# EAGLE design MultiNavFW_9250_RevA (EAGLE 7.2.0)
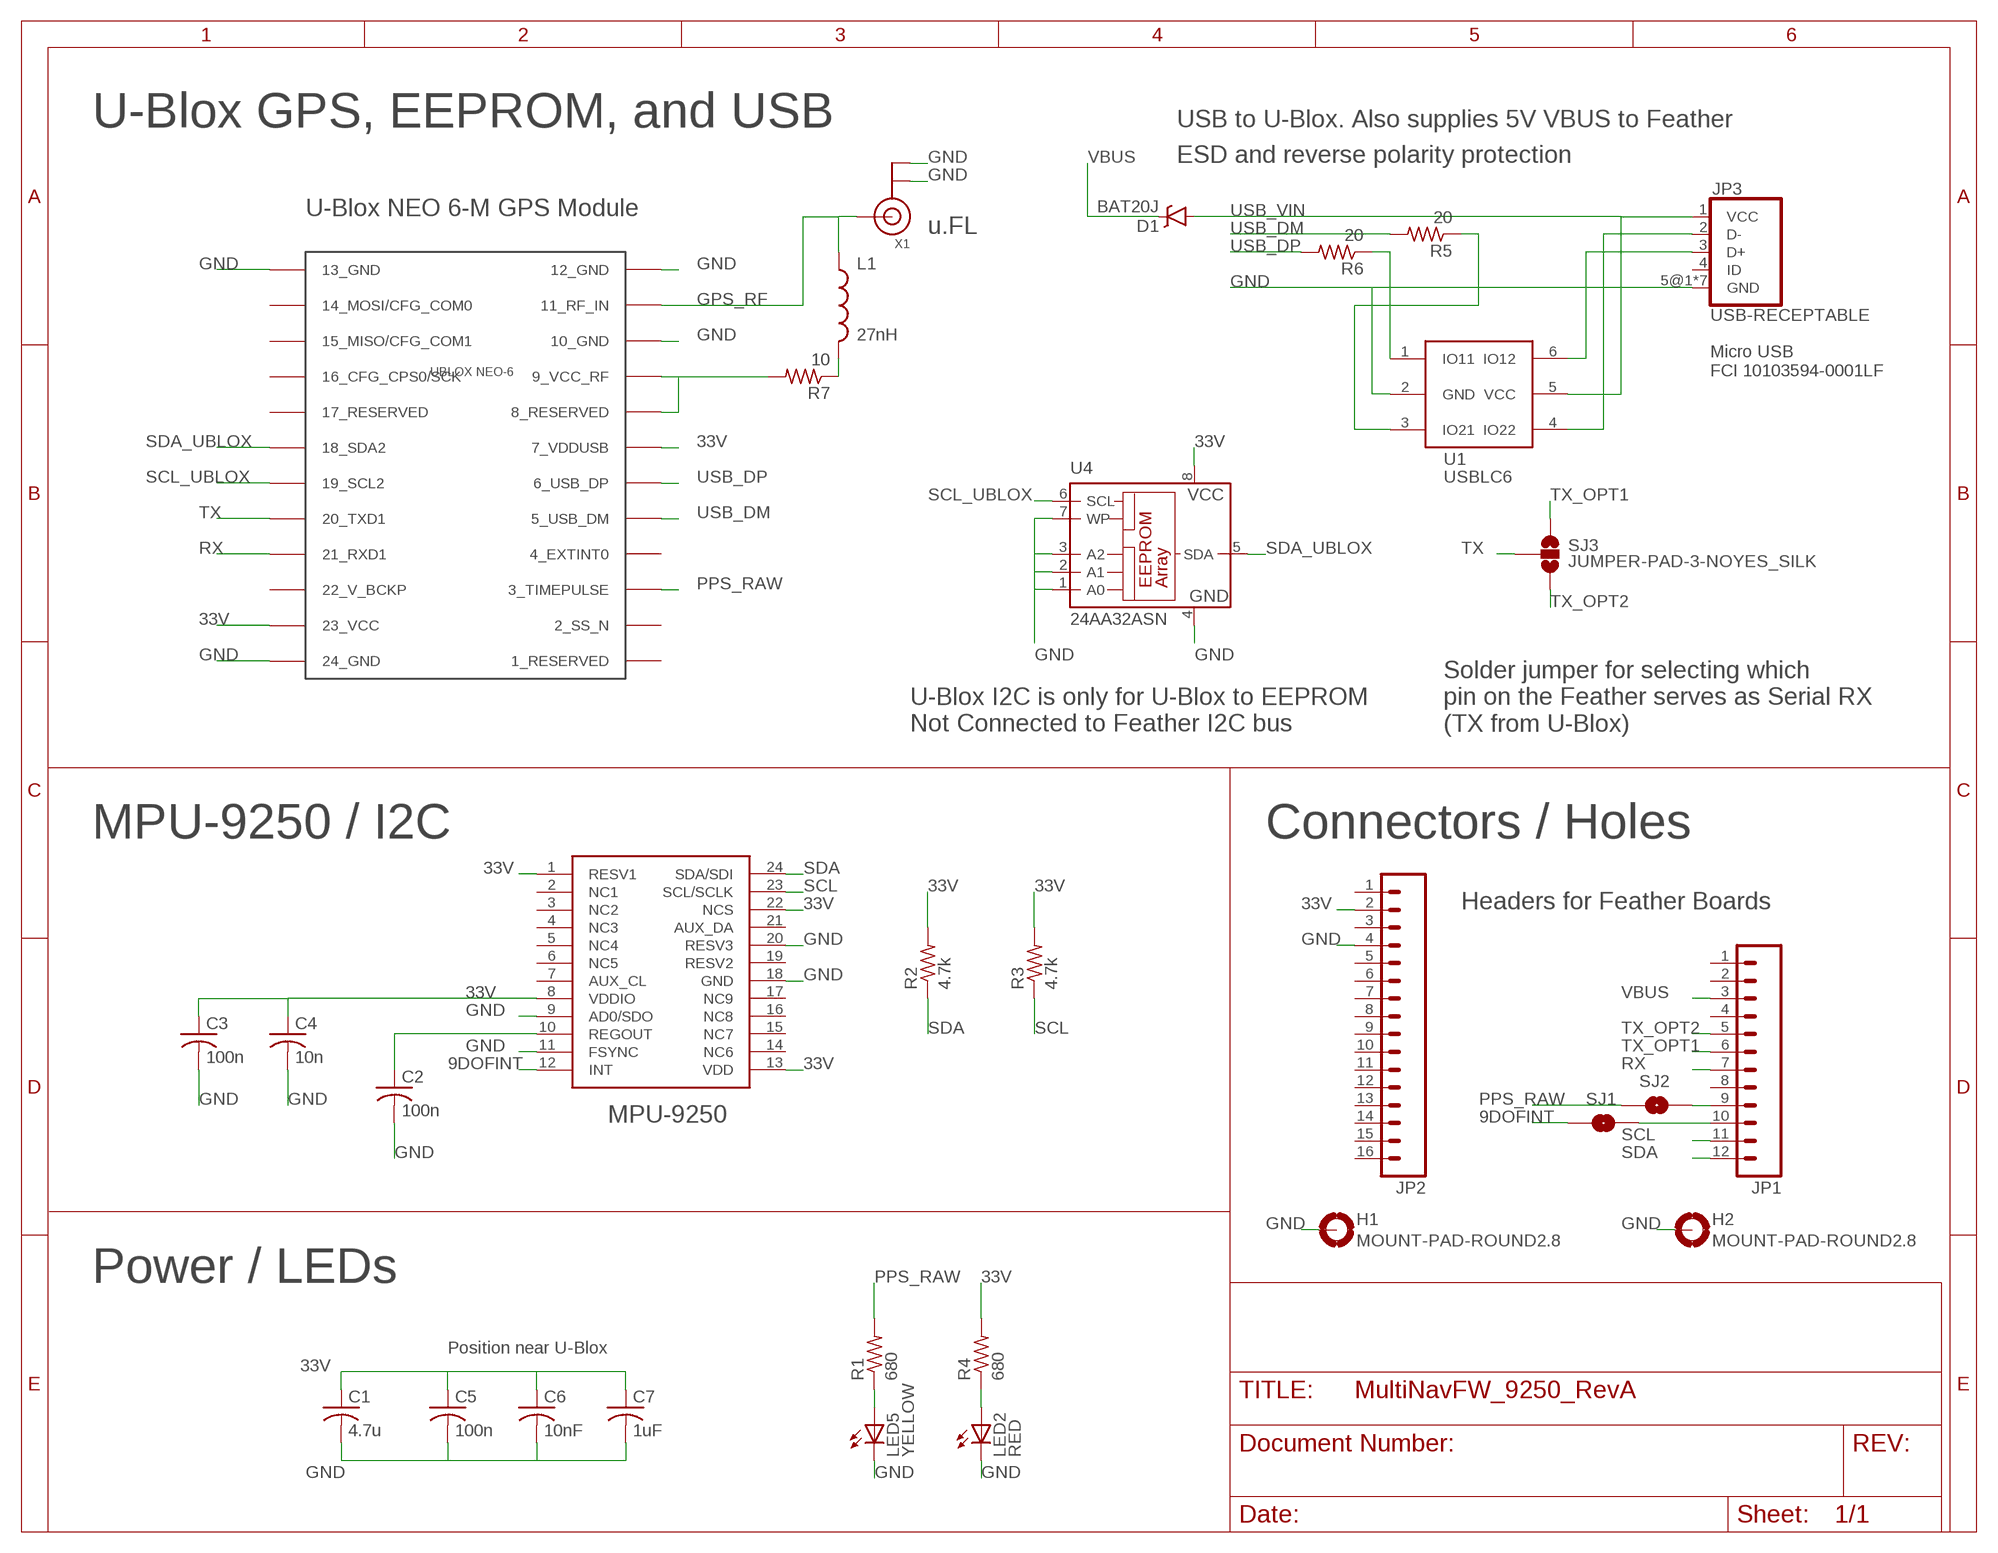
[diagram p0: schematic, sheet 1]

## Parts
C1  4.7u  C-USC0603  [C0603]
C2  100n  C-USC0603  [C0603]
C3  100n  C-USC0603  [C0603]
C4  10n  C-USC0603  [C0603]
C5  100n  C-USC0603  [C0603]
C6  10nF  C-USC0603  [C0603]
C7  1uF  C-USC0603  [C0603]
D1  BAT20J  DIODE-SCHOTTKY-BAT20J  [SOD-323]
H1  MOUNT-PAD-ROUND2.8  [2,8-PAD]
H2  MOUNT-PAD-ROUND2.8  [2,8-PAD]
JP1  M12NO_SILK  [1X12_NO_SILK]
JP2  M161X16_NO_SILK  [1X16_NO_SILK]
JP3  USB-RECEPTABLE  [FCI-10103594-0001LF]
L1  27nH  INDUCTOR0402  [C0402]
LED2  RED  LEDCHIPLED_0603  [CHIPLED_0603]
LED5  YELLOW  LEDCHIPLED_0603  [CHIPLED_0603]
R1  680  R-US_R0603  [R0603]
R2  4.7k  R-US_R0603  [R0603]
R3  4.7k  R-US_R0603  [R0603]
R4  680  R-US_R0603  [R0603]
R5  20  R-US_R0603  [R0603]
R6  20  R-US_R0603  [R0603]
R7  10  R-US_R0603  [R0603]
SJ1  SOLDERJUMPERNO  [SJ_2S-NO]
SJ2  SOLDERJUMPERNO  [SJ_2S-NO]
SJ3  JUMPER-PAD-3-NOYES_SILK  [PAD-JUMPER-3-NO_YES_SILK]
U1  USBLC6-2  [SOT23-6]
U2  MPU-9250  [LEAD-QFN24]
U3  UBLOX_NEO-6  [UBLOX_NEO-6P]
U4  24AA32ASN  [SO-08]
X1  ANTENNA_U.FL  [U.FL]

## Nets
9DOFINT: SJ1.1 U2.12(INT)
33V: C1.1 C3.1 C4.1 C5.1 C6.1 C7.1 JP2.2 R2.2 R3.2 R4.2 U2.1(RESV1) U2.8(VDDIO) U2.13(VDD) U2.22(NCS) U3.7_VDDUSB U3.23_VCC U4.8(VCC)
GND: C1.2 C2.2 C3.2 C4.2 C5.2 C6.2 C7.2 H1.B2,8(MOUNT) H2.B2,8(MOUNT) JP2.4 JP3.5@1(GND) JP3.5@2(GND) JP3.5@3(GND) JP3.5@4(GND) JP3.5@5(GND) JP3.5@6(GND) JP3.5@7(GND) LED2.C LED5.C U1.2(GND) U2.9(AD0/SDO) U2.11(FSYNC) U2.18(GND) U2.20(RESV3) U3.10_GND U3.12_GND U3.13_GND U3.24_GND U4.1(A0) U4.2(A1) U4.3(A2) U4.4(GND) U4.7(WP) X1.1(GND) X1.2(GND)
GPS_BIAS: R7.2 U3.8_RESERVED U3.9_VCC_RF
GPS_RF: L1.1 U3.11_RF_IN X1.3(SIGNAL)
N$1: L1.2 R7.1
N$2: JP3.2(D-) U1.4(IO22)
N$3: R5.1 U1.3(IO21)
N$5: R6.1 U1.1(IO11)
N$6: LED5.A R1.1
N$7: JP3.3(D+) U1.6(IO12)
N$9: LED2.A R4.1
N$10: JP1.10 SJ1.2
N$12: JP1.9 SJ2.2
N$13: C2.1 U2.10(REGOUT)
PPS_RAW: R1.2 SJ2.1 U3.3_TIMEPULSE
RX: JP1.7 U3.21_RXD1
SCL: JP1.11 R3.1 U2.23(SCL/SCLK)
SCL_UBLOX: U3.19_SCL2 U4.6(SCL)
SDA: JP1.12 R2.1 U2.24(SDA/SDI)
SDA_UBLOX: U3.18_SDA2 U4.5(SDA)
TX: SJ3.2 U3.20_TXD1
TX_OPT1: JP1.6 SJ3.1
TX_OPT2: JP1.5 SJ3.3
USB_DM: R5.2 U3.5_USB_DM
USB_DP: R6.2 U3.6_USB_DP
USB_VIN: D1.A JP3.1(VCC) U1.5(VCC)
VBUS: D1.C JP1.3
Unconnected: JP1.1 JP1.2 JP1.4 JP1.8 JP2.1 JP2.3 JP2.5 JP2.6 JP2.7 JP2.8 JP2.9 JP2.10 JP2.11 JP2.12 JP2.13 JP2.14 JP2.15 JP2.16 JP3.4(ID) U2.2(NC1) U2.3(NC2) U2.4(NC3) U2.5(NC4) U2.6(NC5) U2.7(AUX_CL) U2.14(NC6) U2.15(NC7) U2.16(NC8) U2.17(NC9) U2.19(RESV2) U2.21(AUX_DA) U3.1_RESERVED U3.2_SS_N U3.4_EXTINT0 U3.14_MOSI/CFG_COM0 U3.15_MISO/CFG_COM1 U3.16_CFG_CPS0/SCK U3.17_RESERVED U3.22_V_BCKP

## Notes on the sheet
- U-Blox GPS, EEPROM, and USB | USB to U-Blox. Also supplies 5V VBUS to Feather
- ESD and reverse polarity protection
- U-Blox NEO 6-M GPS Module
- u.FL
- Micro USB
  FCI 10103594-0001LF
- USBLC6
- U-Blox I2C is only for U-Blox to EEPROM
  Not Connected to Feather I2C bus
- Solder jumper for selecting which
  pin on the Feather serves as Serial RX
  (TX from U-Blox)
- MPU-9250 / I2C | Connectors / Holes
- Headers for Feather Boards
- MPU-9250
- Power / LEDs
- Position near U-Blox

## Library data of the parts
C1-C7 = adafruit:C-US: CAPACITOR, American symbol
D1 = SparkFun-DiscreteSemi:DIODE-SCHOTTKY: Schottky diodes in SFE's production catalog BAT20J 1A 23V 0.62Vf RB751 120mA 40V 0.37Vf PMEG4005EJ 0.5A 40V 0.42Vf MBRA140 1A 40V 0.5Vf B340A 3A 40V SMA; PROD_ID: DIO-11623
H1 H2 = holes:MOUNT-PAD-ROUND: MOUNTING PAD, round
JP1 = SparkFun-Connectors:M12: Header 12 Standard 12-pin 0.1" header. Use with straight break away headers (SKU : PRT-00116), right angle break away headers (PRT-00553), swiss pins (PRT-00743), machine pins (PRT-00117), and female headers (PRT-00115).
JP2 = SparkFun-Connectors:M16: 1x16 .1" header
JP3 = daspilker:USB-RECEPTABLE: USB Receptable
L1 = SparkFun-Passives:INDUCTOR: Inductors Basic Inductor/Choke - 0603 and 1206. Footprints are not proven and vary greatly between part numbers. SRN6045- 33uH, 20% 1.4A SDR0403-560KL - 56uH, 10%, 500mA RMS/740mA peak
LED2 LED5 = adafruit:LED: LED OSRAM: - CHIPLED LG R971, LG N971, LY N971, LG Q971, LY Q971, LO R971, LY R971 LH N974, LH R974 LS Q976, LO Q976, LY Q976 LO Q996 - Hyper CHIPLED LW Q18S LB Q993, LB Q99A, LB R99A - SideLED LS A670, LO A670, LY A670, LG A670, LP A670 LB A673, LV A673, LT A673, LW A673 LH A674 LY A675 LS A676, LA A676, LO A676, LY A676, LW A676 LS A679, LY A679, LG A679 - Hyper Micro SIDELED® LS Y876, LA Y876, LO Y876, LY Y876 LT Y87S - SmartLED LW L88C, LW L88S LB L89C, LB L89S, LG L890 LS L89K, LO L89K, LY L89K LS L896, LA L896, LO L896, LY L896 - TOPLED LS T670, LO T670, LY T670, LG T670, LP T670 LSG T670, LSP T670, LSY T670, LOP T670, LYG T670 LG T671, LOG T671, LSG T671 LB T673, LV T673, LT T673, LW T673 LH T674 LS T676, LA T676, LO T676, LY T676, LB T676, LH T676, LSB T676, LW T676 LB T67C, LV T67C, LT T67C, LS T67K, LO T67K, LY T67K, LW E67C LS E67B, LA E67B, LO E67B, LY E67B, LB E67C, LV E67C, LT E67C LW T67C LS T679, LY T679, LG T679 LS T770, LO T770, LY T770, LG T770, LP T770 LB T773, LV T773, LT T773, LW T773 LH T774 LS E675, LA E675, LY E675, LS T675 LS T776, LA T776, LO T776, LY T776, LB T776 LHGB T686 LT T68C, LB T68C - Hyper Mini TOPLED® LB M676 - Mini TOPLED Santana® LG M470 LS M47K, LO M47K, LY M47K Source: http://www.osram.convergy.de/
R1-R4 = adafruit2:R-US_: RESISTOR, American symbol
R5-R7 = adafruit:R-US_: RESISTOR, American symbol
SJ1 SJ2 = SparkFun-Retired:SOLDERJUMPER: Solder Jumper Standard SMD solder jumper. Used to automate production. Two varients : Normally Open and Normally Closed are the same, but have different paste layers. NC will have a large amount of paste and should jumper during reflow.
SJ3 = SparkFun-Passives:JUMPER-PAD-3-NO
U1 = _CustomParts:USBLC6-2
U2 = _CustomParts:MPU-9250
U3 = Ava:UBLOX_NEO-6: UBLOX NEO-6 GPS MODULE Author Anthony Stirk / http://ava.upuaut.net http://www.u-blox.com/images/downloads/Product_Docs/LEA-6_NEO-6_MAX_HardwareIntegrationManual_%28GPS.G6-HW-09007%29.pdf http://www.u-blox.com/images/downloads/Product_Docs/NEO-6_DataSheet_%28GPS.G6-HW-09005%29.pdf
U4 = microchip:24*: Serial EEPROM I2C; MF: MICROCHIP; MPN: 24AA32A-I/SN; OC_FARNELL: 1617659; OC_NEWARK: 83C5815
X1 = adafruit:ANTENNA_U.FL: U.FL Antenna Connector

## Net classes
1 power: width 0.305 mm

## Board
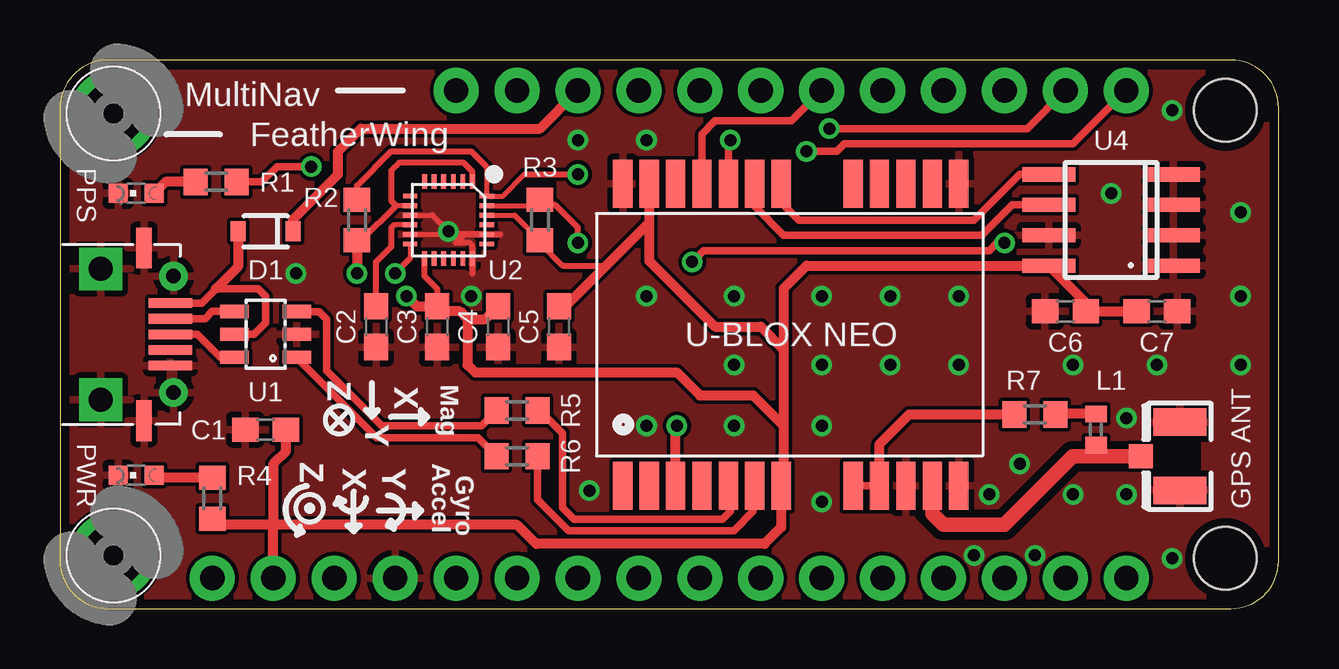
[diagram p1: board, top side]
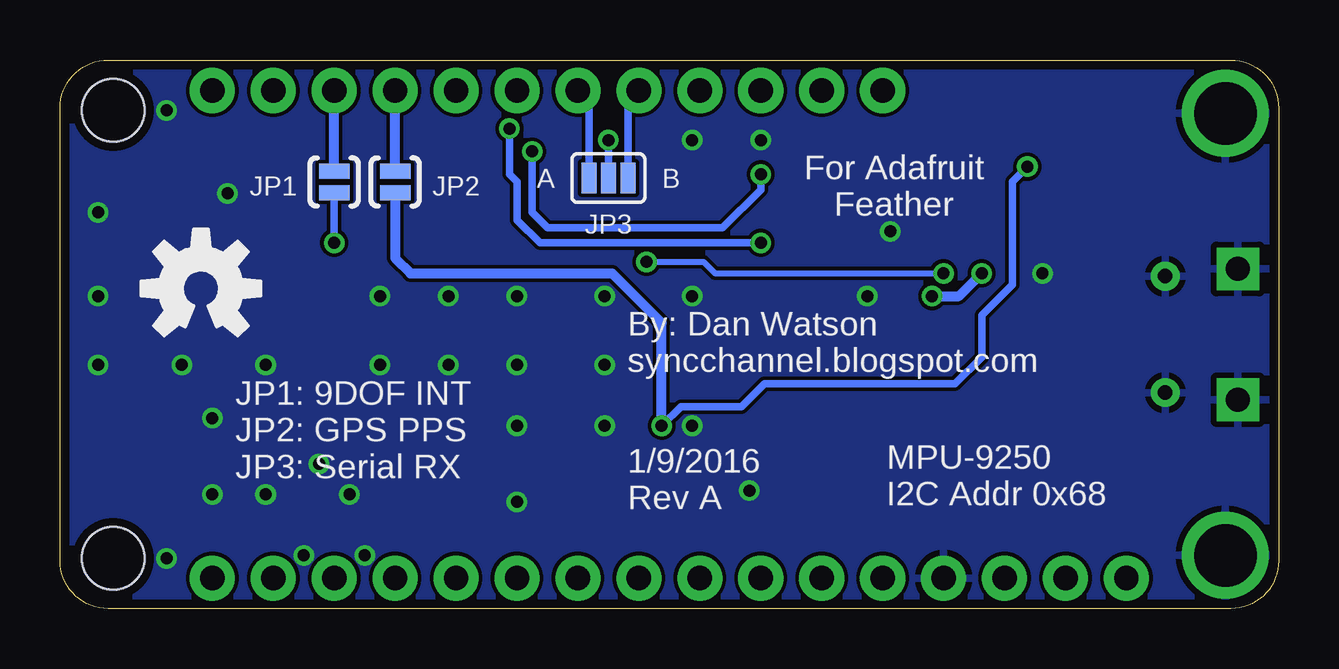
[diagram p2: board, bottom side, seen from below]

Size 50.8 x 22.86 mm. Coordinates in mm from the lower left corner, seen from the top.
Outline: 0,20.86 0,2 arc90 2,0 48.8,0 arc90 50.8,2 50.8,20.86 arc90 48.8,22.86 2,22.86 arc90 0,20.86
Copper layers (1*16): Top 0.0356mm / dielectric 1.5011mm / Bottom 0.0356mm
Design rules "oshpark-2layer *": minimum track width 6mil, minimum drill 13mil, track to track 6mil, track to pad 6mil, pad to pad 6mil, via to via 6mil, smd to smd 6mil, copper to edge 15mil, drill to drill 6mil, minimum pad ring 7mil, minimum via ring 7mil, stop-mask expansion 4mil, vias tented up to drill 20mil, thermal gap 10mil
Holes 2.6 mm at 48.58,20.76 48.58,2.1
tRestrict: 4 lines

### Footprints (pad centres in the part's own frame; a part is rotated, then mirrored left to right if it is on the bottom)
C0603 = smd 1.1 x 1: 1 -0.85,0; 2 0.85,0
SOD-323 = smd 0.63 x 0.83: A 1.15,0; C -1.15,0
2,8-PAD = drill 2.6 pad 3.6: B2,8 0,0
1X12_NO_SILK = drill 1.016 pad 1.88: 1 0,0; 2 2.54,0; 3 5.08,0; 4 7.62,0; 5 10.16,0; 6 12.7,0; 7 15.24,0; 8 17.78,0; 9 20.32,0; 10 22.86,0; 11 25.4,0; 12 27.94,0
1X16_NO_SILK = drill 1.016 pad 1.88: 1 0,0; 2 2.54,0; 3 5.08,0; 4 7.62,0; 5 10.16,0; 6 12.7,0; 7 15.24,0; 8 17.78,0; 9 20.32,0; 10 22.86,0; 11 25.4,0; 12 27.94,0; 13 30.48,0; 14 33.02,0; 15 35.56,0; 16 38.1,0
FCI-10103594-0001LF = smd 0.4 x 1.8: 1 -1.3,4.6; 2 -0.65,4.6; 3 0,4.6; 4 0.65,4.6; 5@1 1.3,4.6 | drill 0.6 pad 1.2: 5@2 -2.425,4.73; 5@3 2.425,4.73 | drill 1 pad 1.778 square: 5@4 -2.725,1.7; 5@5 2.725,1.7 | smd 1.7 x 0.635: 5@6 -3.6,3.5; 5@7 3.6,3.5
C0402 = smd 0.7 x 0.9: 1 -0.65,0; 2 0.65,0
CHIPLED_0603 = smd 0.8 x 0.8: A 0,-0.75; C 0,0.75
R0603 = smd 1 x 1.1: 1 -0.85,0; 2 0.85,0
SJ_2S-NO = smd 0.635 x 1.27: 1 -0.45,0; 2 0.45,0
PAD-JUMPER-3-NO_YES_SILK = smd 0.635 x 1.27: 1 -0.813,0; 2 0,0; 3 0.813,0
SOT23-6 = smd 0.55 x 1.2: 1 -0.95,-1.3; 2 0,-1.3; 3 0.95,-1.3; 4 0.95,1.3; 5 0,1.3; 6 -0.95,1.3
LEAD-QFN24 = smd 0.6 x 0.2: 1 -1.6,1; 2 -1.6,0.6; 3 -1.6,0.2; 4 -1.6,-0.2; 5 -1.6,-0.6; 6 -1.6,-1; 13 1.6,-1; 14 1.6,-0.6; 15 1.6,-0.2; 16 1.6,0.2; 17 1.6,0.6; 18 1.6,1 | smd 0.2 x 0.6: 7 -1,-1.6; 8 -0.6,-1.6; 9 -0.2,-1.6; 10 0.2,-1.6; 11 0.6,-1.6; 12 1,-1.6; 19 1,1.6; 20 0.6,1.6; 21 0.2,1.6; 22 -0.2,1.6; 23 -0.6,1.6; 24 -1,1.6
UBLOX_NEO-6P = smd 2 x 0.8: 1_RESERVED 6.319,-7.019; 2_SS_N 6.319,-5.919; 3_TIMEPULSE 6.319,-4.819; 4_EXTINT0 6.319,-3.719; 5_USB_DM 6.319,-2.619; 6_USB_DP 6.319,-1.519; 7_VDDUSB 6.319,-0.419; 8_RESERVED 6.319,2.581; 9_VCC_RF 6.319,3.681; 10_GND 6.319,4.781; 11_RF_IN 6.319,5.881; 12_GND 6.319,6.981; 13_GND -6.281,6.981; 14_MOSI/CFG_COM0 -6.281,5.881; 15_MISO/CFG_COM1 -6.281,4.781; 16_CFG_CPS0/SCK -6.281,3.681; 17_RESERVED -6.281,2.581; 18_SDA2 -6.281,-0.419; 19_SCL2 -6.281,-1.519; 20_TXD1 -6.281,-2.619; 21_RXD1 -6.281,-3.719; 22_V_BCKP -6.281,-4.819; 23_VCC -6.281,-5.919; 24_GND -6.281,-7.019
SO-08 = smd 0.6 x 2.2: 1 -1.905,-2.6; 2 -0.635,-2.6; 3 0.635,-2.6; 4 1.905,-2.6; 5 1.905,2.6; 6 0.635,2.6; 7 -0.635,2.6; 8 -1.905,2.6
U.FL = smd 2.2 x 1.15: 1 0,1.425; 2 0,-1.425 | smd 1 x 1: 3 1.625,0

### Placement (x,y rotation side)
C1  8.57,7.46 180 top
C2  13.18,11.75 270 top
C3  15.72,11.75 270 top
C4  18.26,11.75 270 top
C5  20.8,11.75 270 top
C6  41.91,12.38 180 top
C7  45.72,12.38 0 top
D1  8.57,15.72 180 top
H1  2.22,20.64 0 top
H2  2.22,2.22 0 top
JP1  16.51,21.59 0 top
JP2  6.35,1.27 0 top
JP3  0,11.43 270 top
L1  43.18,7.46 90 top
LED2  3.17,5.56 90 top
LED5  3.17,17.3 90 top
R1  6.51,17.78 0 top
R2  12.38,16.19 270 top
R3  20,16.19 270 top
R4  6.35,4.6 270 top
R5  19.05,8.26 0 top
R6  19.05,6.35 0 top
R7  40.64,8.1 180 top
SJ1  39.37,17.78 90 bottom
SJ2  36.83,17.78 90 bottom
SJ3  27.94,17.94 0 bottom
U1  8.57,11.43 90 top
U2  16.19,16.19 270 top
U3  30.48,11.43 270 top
U4  43.81,16.19 90 top
U$1  [OSHW-LOGO-M]  44.93,13.34 0 bottom
X1  46.67,6.35 180 top

### Tracks (layer width: path | path; a pad name or v marks a point on that pad's centre or on a via)
9DOFINT  (via drill 0.5)
  Top 0.203: U2.12 14.59,14.59
  Top 0.254: 14.19,14.19 v13.97,13.97 14.59,14.59
  Top 0.305: v39.37,15.24 39.05,15.24 38.73,14.92 26.83,14.92 v26.35,14.45
  Bottom 0.254: v26.35,14.45 23.97,14.45 23.5,13.97 v13.97,13.97
  Bottom 0.305: SJ1.1 v39.37,15.24
33V  (via drill 0.5)
  Top 0.203: R3.2 18.95,16.39 U2.22 | U2.8 14.01,16.79
  Top 0.254: R3.2 20,15.24 20.95,14.29 22.77,14.29 | U2.1 17.19,18.21 16.83,18.57 14.13,18.57 13.81,18.26 13.81,16.99 14.01,16.79 12.55,15.34 R2.2 | U2.13 15.19,13.86 15.72,13.34 C3.1
  Top 0.406: U3.23_VCC 24.56,16.08 | 8.89,3.49 19.05,3.49 19.84,2.7 29.37,2.7 30.06,3.39 U3.7_VDDUSB 30.16,5.21 30.16,7.62 | 8.89,3.49 6.61,3.49 R4.2 | 16.99,12.06 16.99,10.16 17.3,9.84 25.72,9.84 26.67,8.89 28.89,8.89 30.16,7.62 | 30.16,10.79 30.16,13.34 31.11,14.29 U4.8 42.76,12.74 C6.1 C7.1 | 30.16,10.79 30.16,7.62 | 24.56,16.08 22.77,14.29 21.08,12.6 C5.1 | 24.56,16.08 24.56,14.49 27.3,11.75 29.21,11.75 30.16,10.79 | JP2.2 8.89,3.49 | 16.99,12.06 16.67,12.38 15.93,12.38 C3.1 14.87,12.6 v14.45,13.02 | 8.89,3.49 8.89,6.03 9.42,6.57 C1.1 | R2.2 v12.38,13.97 | 16.99,12.06 17.72,12.06 C4.1
  Bottom 0.406: v14.45,13.02 13.34,13.02 v12.38,13.97
GND  (via drill 0.5)
  Top 0.203: U2.11 16.07,15.59 | U2.9 15.52,16.39
  Top 0.254: 16.07,15.59 v16.19,15.72 | 15.52,16.39 v16.19,15.72 | U2.20 16.32,15.59 v16.19,15.72 | 17.2,13.97 17.2,15.11 17.07,15.24 16.67,15.24 | 18.36,15.6 16.87,15.6 16.51,15.24 16.67,15.24 | 16.67,15.24 v16.19,15.72
  other vias: 46.35,2.1 44.45,4.76 42.23,4.76 38.73,4.76 40.64,2.22 38.1,2.22 40.01,6.03 42.23,10.16 45.72,10.16 49.21,10.16 37.47,10.16 34.61,10.16 31.75,10.16 31.75,7.62 37.47,13.02 34.61,13.02 31.75,13.02 28.1,10.16 28.1,7.62 24.45,13.02 24.45,7.62 44.45,7.94 43.81,17.3 49.21,13.02 22.07,4.92 31.75,4.45 46.35,20.76 49.21,16.51 17.14,13.02 28.1,13.02 9.84,13.97 21.59,19.53 24.45,19.53
  pour Top: -6.35,26.67 -6.35,-3.81 54.61,-3.81 54.61,26.67
  pour Bottom: -7.62,27.94 -7.62,-5.08 55.88,-5.08 55.88,29.21 -7.62,29.21
GPS_BIAS
  Top 0.305: U3.9_VCC_RF U3.8_RESERVED
  Top 0.406: U3.9_VCC_RF 34.16,6.86 35.4,8.1 R7.2
GPS_RF
  Top 0.305: L1.1 43.18,6.35
  Top 0.61: U3.11_RF_IN 36.36,3.96 36.83,3.49 39.37,3.49 42.23,6.35 43.18,6.35 X1.3
N$1
  Top 0.305: 41.66,8.11 R7.1
  Top 0.406: L1.2 41.66,8.11
N$2
  Top 0.305: U1.4 7.59,12.38 6.35,12.38 6.05,12.08 JP3.2
N$3
  Top 0.305: U1.3 10.8,12.38 11.11,12.06 11.11,9.92 13.41,7.62 17.57,7.62 R5.1
N$5
  Top 0.305: R6.1 17.43,7.12 13.2,7.12 9.87,10.45 U1.1
N$6
  Top 0.406: R1.1 4.4,17.78 LED5.A
N$7
  Top 0.305: U1.6 7.59,10.48 6.67,10.48 5.71,11.43 JP3.3
N$9
  Top 0.406: R4.1 4.03,5.45 LED2.A
N$10
  Bottom 0.406: SJ1.2 JP1.10
N$12
  Bottom 0.406: SJ2.2 JP1.9
N$13
  Top 0.203: U2.10 13.93,15.99
  Top 0.254: C2.1 13.18,14.45 13.81,15.08 13.81,15.88 13.93,15.99
PPS_RAW  (via drill 0.5)
  Top 0.305: R1.2 8.41,17.78 9.05,18.41 v10.48,18.41
  Top 0.406: U3.3_TIMEPULSE 25.66,7.56 v25.72,7.62
  Bottom 0.305: v25.72,7.62 24.92,8.41 22.38,8.41 21.43,9.37 13.49,9.37 12.38,10.48 12.38,12.22 11.11,13.49 11.11,17.78 v10.48,18.41
  Bottom 0.406: SJ2.1 36.83,14.61 36.2,13.97 27.78,13.97 25.72,11.91 v25.72,7.62
RX
  Top 0.305: U3.21_RXD1 26.76,19.78 27.3,20.32 30.48,20.32 JP1.7
SCL  (via drill 0.5)
  Top 0.203: U2.23 20,16.79
  Top 0.254: 19.9,16.94 R3.1 | v21.59,15.24 21.59,15.88 20.64,16.83 20.22,16.83 R3.1 | 19.75,16.79 R3.1 | 20,16.79 R3.1
  Top 0.305: JP1.11 40.32,20 v32.07,20
  Bottom 0.305: v21.59,15.24 30.8,15.24 31.75,16.19 31.75,17.78 32.07,18.1 v32.07,20
SCL_UBLOX
  Top 0.305: U3.19_SCL2 28.96,16.76 30.16,15.56 38.42,15.56 39.69,16.83 U4.6
SDA  (via drill 0.5)
  Top 0.203: 17.78,18.41 U2.24 18.46,17.19 19.37,18.1
  Top 0.254: R2.1 12.38,17.62 13.81,19.05 17.14,19.05 17.78,18.41 | 19.37,18.1 v21.59,18.1
  Top 0.305: v31.11,19.05 32.38,19.05 32.7,19.37 42.23,19.37 JP1.12
  Bottom 0.305: v21.59,18.1 21.59,17.46 23.18,15.88 30.48,15.88 31.11,16.51 v31.11,19.05
SDA_UBLOX
  Top 0.305: U3.18_SDA2 30.06,16.93 30.8,16.19 38.1,16.19 40.01,18.1 U4.5
TX  (via drill 0.5)
  Top 0.305: U3.20_TXD1 27.86,19.45 v27.94,19.53
  Bottom 0.305: SJ3.2 v27.94,19.53
TX_OPT1
  Bottom 0.305: SJ3.1 28.75,21.13 JP1.6
TX_OPT2
  Bottom 0.305: SJ3.3 27.13,21.13 JP1.5
USB_DM
  Top 0.305: U3.5_USB_DM 27.94,5.03 27.94,4.05 27.62,3.73 21.43,3.73 20.95,4.21 20.95,7.3 20,8.26 R5.2
USB_DP
  Top 0.305: U3.6_USB_DP 28.89,5.04 28.89,4.05 28.1,3.25 21.19,3.25 19.9,4.55 R6.2
USB_VIN
  Top 0.305: U1.5 8.1,11.43 8.57,11.91 8.57,13.02 8.26,13.34 6.51,13.34 5.9,12.73 JP3.1
  Top 0.406: D1.A 7.42,14.25 6.51,13.34
VBUS
  Top 0.406: D1.C 9.72,16.23 11.59,18.1 11.59,19.05 12.54,20 20,20 JP1.3

### Text on the board
tPlace: Z | X | Mag | Y | Z | X | Y | Accel | Gyro
tNames: MultiNav | FeatherWing | U4 | R1 | R3 | PPS | R2 | D1 | U2 | C2 | C3 | C4 | C5 | U-BLOX NEO | C6 | C7 | R7 | L1 | U1 | R5 | C1 | GPS ANT | PWR | R4 | R6
bNames: For Adafruit / Feather | B | A | JP2 | JP1 | JP3 | By: Dan Watson / syncchannel.blogspot.com | JP1: 9DOF INT / JP2: GPS PPS / JP3: Serial RX | MPU-9250 / I2C Addr 0x68 | 1/9/2016 / Rev A